# Altium schematic sheet ETHERNET.SchDoc: ETHERHET
size 420 x 297 mm; DrawnBy: Orhun Dabak; Revision: 1.0; SheetNumber: 4; SheetTotal: 7
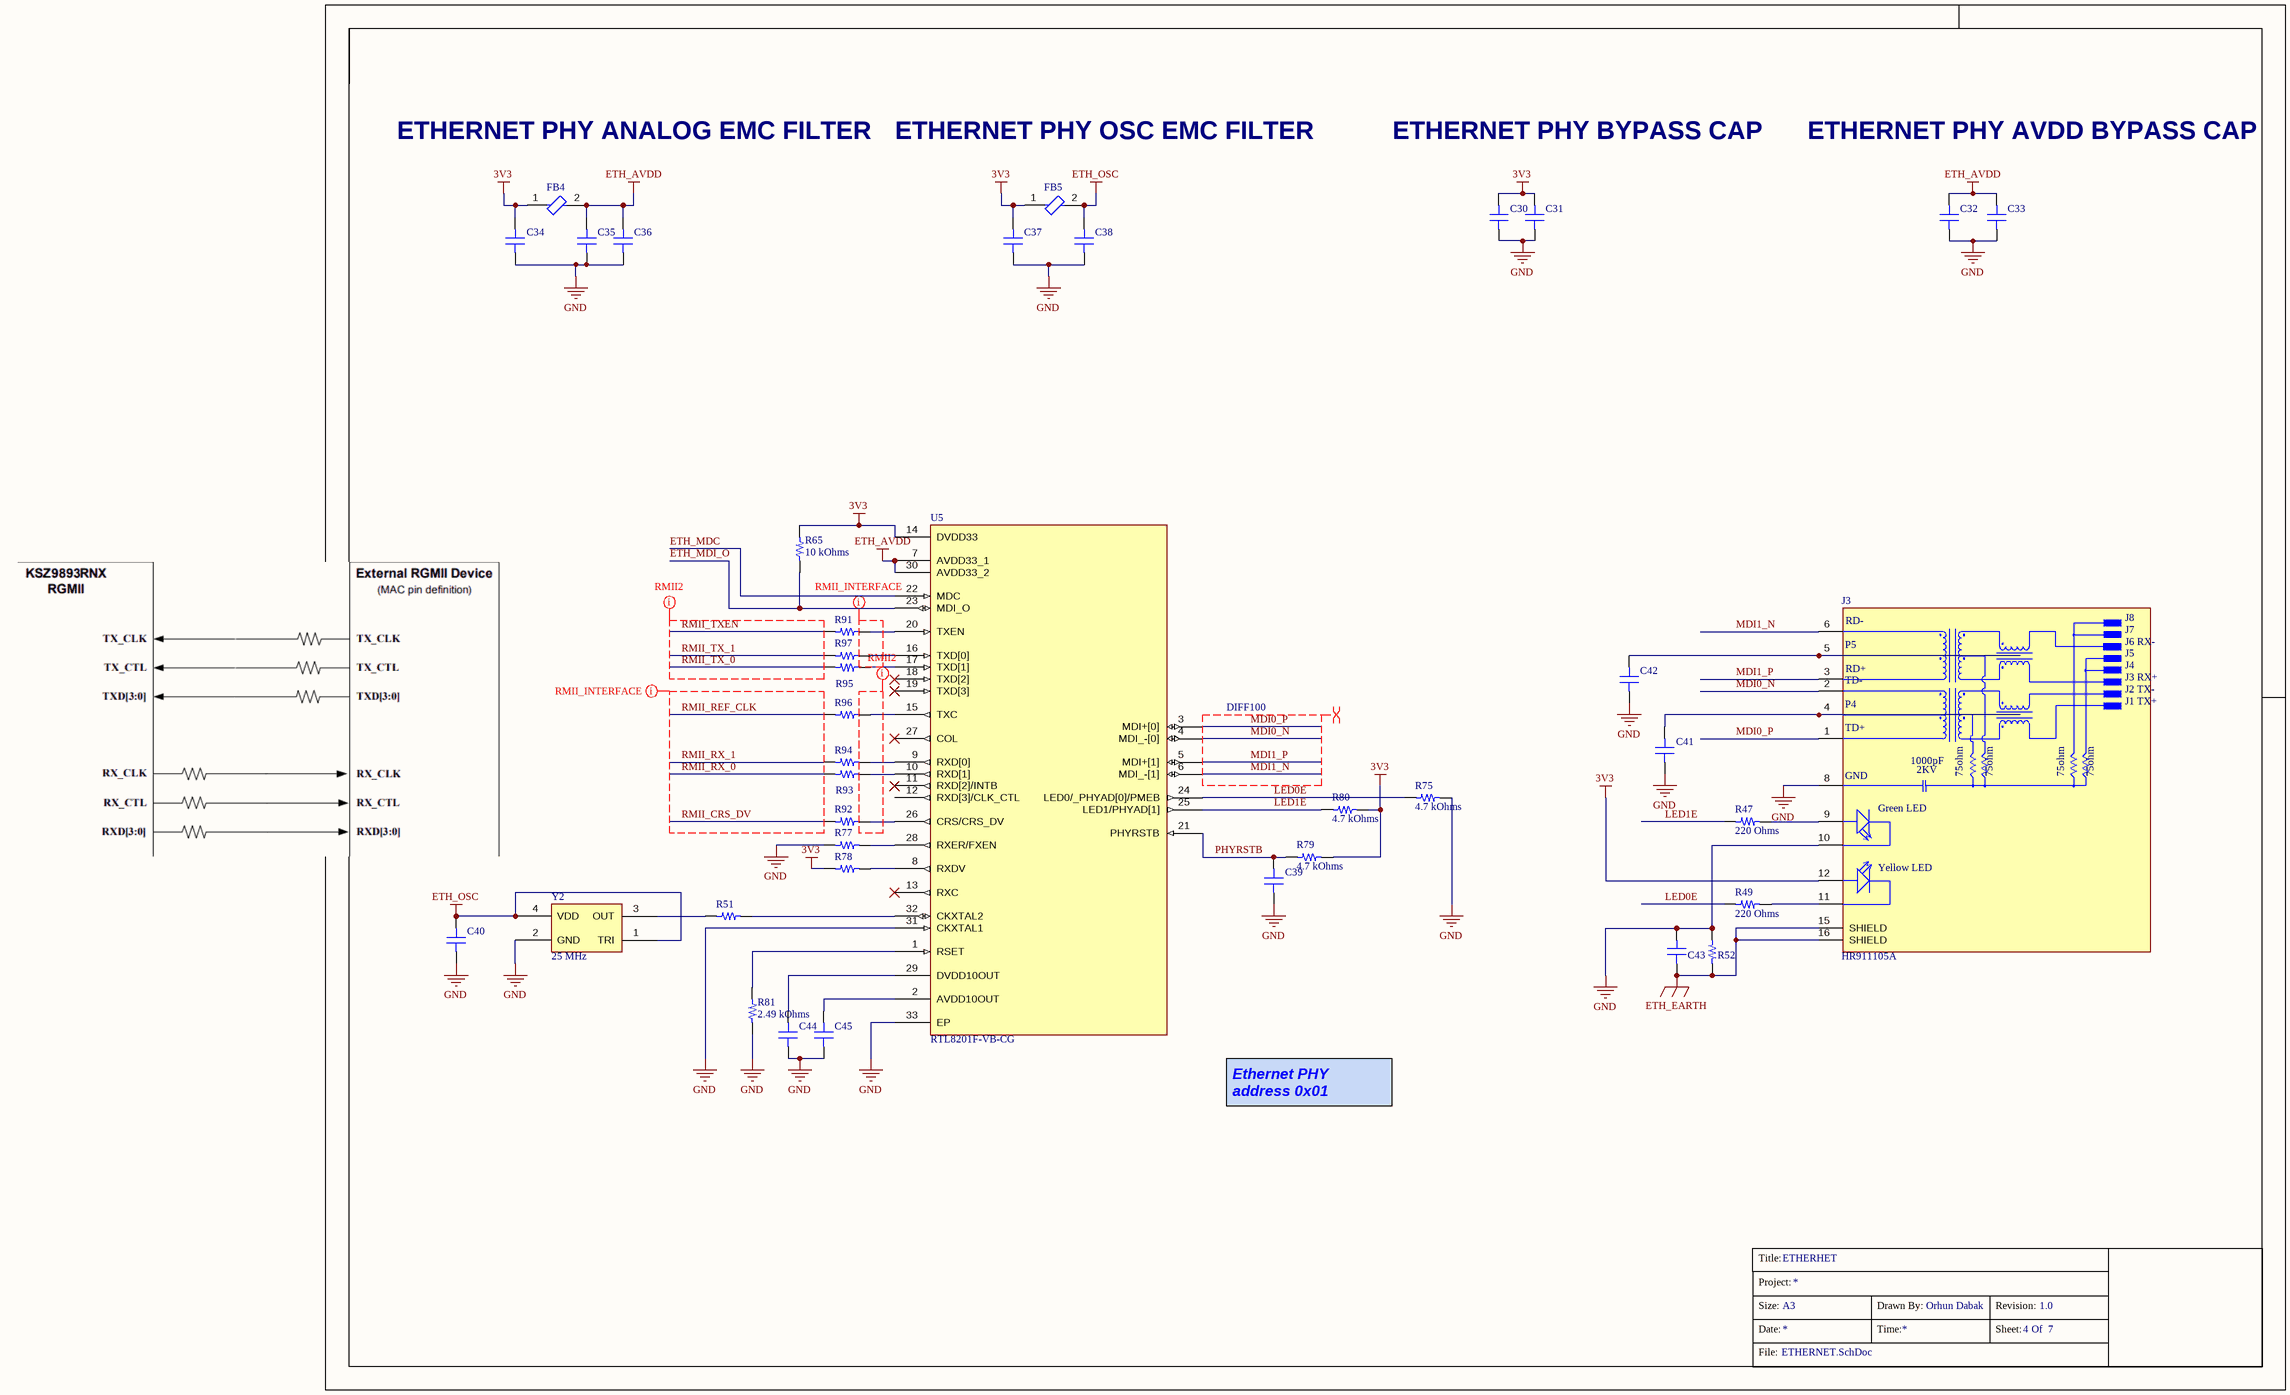
[diagram p0: ETHERNET.SchDoc]

## Parts
?  (no value)  (graphical)
C30  0.1 µF  [CAP 0402_1005]  (value not drawn)
C31  2.2 µF  [CAP 0402_1005]  (value not drawn)
C32  0.1 µF  [CAP 0402_1005]  (value not drawn)
C33  0.1 µF  [CAP 0402_1005]  (value not drawn)
C34  0.1 µF  [CAP 0402_1005]  (value not drawn)
C35  0.1 µF  [CAP 0402_1005]  (value not drawn)
C36  4.7 µF  [CAP 0402_1005]  (value not drawn)
C37  4.7 µF  [CAP 0402_1005]  (value not drawn)
C38  4.7 µF  [CAP 0402_1005]  (value not drawn)
C39  1000pF  [CAP 0402_1005]  (value not drawn)
C40  0.1 µF  [CAP 0402_1005]  (value not drawn)
C41  10000 pF  [CAP 0402_1005]  (value not drawn)
C42  10000 pF  [CAP 0402_1005]  (value not drawn)
C43  4700 pF  [CAP 0402_1005]  (value not drawn)
C44  0.1 µF  [CAP 0402_1005]  (value not drawn)
C45  0.1 µF  [CAP 0402_1005]  (value not drawn)
FB4  BLM15AX601SN1D  [FP-BLM15-0_05-IPC_B]  (value not drawn)
FB5  BLM15AX601SN1D  [FP-BLM15-0_05-IPC_B]  (value not drawn)
J3  HR911105A  [HANRUN_HR911105A]
R47  220 Ohms  [RES 0402_1005]
R49  220 Ohms  [RES 0402_1005]
R51  22 Ohms  [RES 0402_1005]  (value not drawn)
R52  1 MOhms  [RES 0402_1005]  (value not drawn)
R65  10 kOhms  [RES 0402_1005]
R75  4.7 kOhms  [RES 0402_1005]
R77  4.7 kOhms  [RES 0402_1005]  (value not drawn)
R78  10 kOhms  [RES 0402_1005]  (value not drawn)
R79  4.7 kOhms  [RES 0402_1005]
R80  4.7 kOhms  [RES 0402_1005]
R81  2.49 kOhms  [RES 0402_1005]
R91  33 Ohms  [RES 0402_1005]  (value not drawn)
R92  33 Ohms  [RES 0402_1005]  (value not drawn)
R93  33 Ohms  [RES 0402_1005]  (value not drawn)
R94  33 Ohms  [RES 0402_1005]  (value not drawn)
R95  33 Ohms  [RES 0402_1005]  (value not drawn)
R96  33 Ohms  [RES 0402_1005]  (value not drawn)
R97  33 Ohms  [RES 0402_1005]  (value not drawn)
U5  RTL8201F-VB-CG  [QFN50P500X500X100_HS-33N]
Y2  25 MHz  [ABRACON ASE]

## Nets
3V3: C30.2 C31.2 C34.2 C37.2 FB4.1 FB5.1 J3.12(YA) R65.1 R78.1 R79.2 R80.2 U5.14(DVDD33)
ETH_AVDD: C32.2 C33.2 C35.2 C36.2 FB4.2 U5.7(AVDD33_1) U5.30(AVDD33_2)
ETH_EARTH: C43.1 J3.15(SHIELD) J3.16(SHIELD) R52.1
ETH_OSC: C38.2 C40.2 FB5.2 Y2.1(TRI) Y2.4(VDD)
GND: C30.1 C31.1 C32.1 C33.1 C34.1 C35.1 C36.1 C37.1 C38.1 C39.1 C40.1 C41.1 C42.1 C43.2 C44.1 C45.1 J3.8(GND) J3.10(GC) R52.2 R75.2 R77.1 R81.1 U5.31(CKXTAL1) U5.33(EP) Y2.2(GND)
ETH_MDC: U5.22(MDC)
ETH_MDI_O: R65.2 U5.23(MDI_O)
LED0E: R49.2 R75.1 U5.24(LED0/_PHYAD[0]/PMEB)
LED1E: R47.2 R80.1 U5.25(LED1/PHYAD[1])
MDI0_N: J3.2(TD-) U5.4(MDI_-[0])
MDI0_P: J3.1(TD+) U5.3(MDI+[0])
MDI1_N: J3.6(RD-) U5.6(MDI_-[1])
MDI1_P: J3.3(RD+) U5.5(MDI+[1])
PHYRSTB: C39.2 R79.1 U5.21(PHYRSTB)
RMII_CRS_DV: R92.1
RMII_REF_CLK: R96.1
RMII_RX_0: R93.1
RMII_RX_1: R94.1
RMII_TX_0: R95.1
RMII_TX_1: R97.1
RMII_TXEN: R91.1
NetC41_2: C41.2 J3.4(P4)
NetC42_2: C42.2 J3.5(P5)
NetC44_2: C44.2 U5.29(DVDD10OUT)
NetC45_2: C45.2 U5.2(AVDD10OUT)
NetJ3_9: J3.9(GA) R47.1
NetJ3_11: J3.11(YC) R49.1
NetR51_1: R51.1 Y2.3(OUT)
NetR51_2: R51.2 U5.32(CKXTAL2)
NetR77_2: R77.2 U5.28(RXER/FXEN)
NetR78_2: R78.2 U5.8(RXDV)
NetR81_2: R81.2 U5.1(RSET)
NetR91_2: R91.2 U5.20(TXEN)
NetR92_2: R92.2 U5.26(CRS/CRS_DV)
NetR93_2: R93.2 U5.10(RXD[1])
NetR94_2: R94.2 U5.9(RXD[0])
NetR95_2: R95.2 U5.17(TXD[1])
NetR96_2: R96.2 U5.15(TXC)
NetR97_2: R97.2 U5.16(TXD[0])

Not connected (* = marked no-connect by the designer): U5 11(RXD[2]/INTB)* 12(RXD[3]/CLK_CTL) 13(RXC)* 18(TXD[2])* 19(TXD[3])* 27(COL)*

## Layout directives
net class SING_END50; net class RMII: (no net found under the mark), RMII_CRS_DV, RMII_REF_CLK, RMII_RX_0, RMII_RX_1
differential pair; differential pair class DIFF100: MDI0_N, MDI0_P, MDI1_N, MDI1_P
net class RMII2; net class SING_END50: (no net found under the mark), RMII_TX_0, RMII_TX_1, RMII_TXEN

## Notes on the sheet
- ETHERNET PHY ANALOG EMC FILTER
- ETHERNET PHY OSC EMC FILTER
- ETHERNET PHY BYPASS CAP
- ETHERNET PHY AVDD BYPASS CAP
- Ethernet PHY address 0x01
- Title:
- Project:
- Size:
- Date:
- File:
- A3
- Time:
- Drawn By:
- Sheet:
- Revision:
- Of
- (in symbol HR911105A) J8; J7; J6 RX-; J5; J4; J3 RX+; J2 TX-; J1 TX+; 1000pF; 2KV; 75ohm; Green LED; Yellow LED

## Library data of the parts
? = Title_Block
C30 C32-C35 C40 C44 C45 = CC0402KRX7R6BB104: CAP CER 0.1UF 10V X7R 0402; manufacturer: Yageo; Tolerance: ±10%; Part Number: CC0402KRX7R6BB104; Value: 0.1 µF; Applications: General Purpose; Capacitance: 0.1 µF; componentlink1description: Datasheet; componentlink1url: https://www.yageo.com/upload/media/product/productsearch/datasheet/mlcc/UPY-GPHC_X7R_6.3V-to-50V_18.pdf; componentlink2description: DigiKey Link; componentlink2url: https://www.digikey.com/en/products/detail/yageo/CC0402KRX7R6BB104/2103083; Device Package: 0402 (1005 Metric); lastupdated: 19/09/2022 12:57:28; Lifecycle Status: Active; Minimum Order: 1; Mounting Type: Surface Mount, MLCC; Operating Temperature: -55°C ~ 125°C; Package / Case: 0402 (1005 Metric); packaging: CutTape; partid: 3877; Part Status: Active; price: 0.01; series: CC; Size / Dimension: 0.039" L x 0.020" W (1.00mm x 0.50mm); Supplier 1: DigiKey; Supplier Part Number 1: 311-1345-1-ND; Temperature Coefficient: X7R; Thickness (Max): 0.022" (0.55mm); Voltage - Rated: 10V
C31 = C0402C225M8PAC7867: CAP CER 2.2UF 10V X5R 0402; manufacturer: KEMET; Tolerance: ±20%; Part Number: C0402C225M8PAC7867; Value: 2.2 µF; Applications: Bypass, Decoupling; Capacitance: 2.2 µF; componentlink1description: Datasheet; componentlink1url: https://connect.kemet.com:7667/gateway/IntelliData-ComponentDocumentation/1.0/download/datasheet/C0402C225M8PACTU; componentlink2description: DigiKey Link; componentlink2url: https://www.digikey.com/en/products/detail/kemet/C0402C225M8PAC7867/3317581; Device Package: 0402 (1005 Metric); lastupdated: 19/09/2022 12:56:38; Lifecycle Status: Active; Minimum Order: 1; Mounting Type: Surface Mount, MLCC; Operating Temperature: -55°C ~ 85°C; Package / Case: 0402 (1005 Metric); packaging: TapeAndReel; partid: 44976; Part Status: Active; price: 0.02; series: SMD Comm X5R; Size / Dimension: 0.039" L x 0.020" W (1.00mm x 0.50mm); Supplier 1: DigiKey; Supplier Part Number 1: 399-C0402C225M8PAC7867CT-ND; Temperature Coefficient: X5R; Thickness (Max): 0.022" (0.55mm); Voltage - Rated: 10V
C36-C38 = CL05A475MP5NRNC: CAP CER 4.7UF 10V X5R 0402; manufacturer: Samsung Electro-Mechanics; Tolerance: ±20%; Part Number: CL05A475MP5NRNC; Value: 4.7 µF; Applications: General Purpose; Capacitance: 4.7 µF; componentlink1description: Datasheet; componentlink1url: http://www.samsungsem.com/kr/support/product-search/mlcc/CL05A475MP5NRNC.jsp; componentlink2description: DigiKey Link; componentlink2url: https://www.digikey.com/en/products/detail/samsung-electro-mechanics/CL05A475MP5NRNC/3887140; Device Package: 0402 (1005 Metric); lastupdated: 19/09/2022 12:57:17; Lifecycle Status: Active; Minimum Order: 1; Mounting Type: Surface Mount, MLCC; Operating Temperature: -55°C ~ 85°C; Package / Case: 0402 (1005 Metric); packaging: TapeAndReel; partid: 7650; Part Status: Active; price: 0.01; series: CL; Size / Dimension: 0.039" L x 0.020" W (1.00mm x 0.50mm); Supplier 1: DigiKey; Supplier Part Number 1: 1276-1482-1-ND; Temperature Coefficient: X5R; Thickness (Max): 0.022" (0.55mm); Voltage - Rated: 10V
C39 = 0402ZC102KAT2A: CAP CER 1000PF 10V X7R 0402; manufacturer: AVX Corporation; Tolerance: ±10%; Part Number: 0402ZC102KAT2A; Value: 1000pF; Applications: General Purpose; Capacitance: 1000pF; componentlink1description: Datasheet; componentlink1url: http://datasheets.avx.com/X7RDielectric.pdf; componentlink2description: DigiKey Link; componentlink2url: http://digikey.com/product-detail/en/avx-corporation/0402ZC102KAT2A/478-12663-1-ND/9949195; Device Package: 0402 (1005 Metric); lastupdated: 08/02/2022 12:26:49; Lifecycle Status: Active; Minimum Order: 1; Mounting Type: Surface Mount, MLCC; Operating Temperature: -55°C ~ 125°C; Package / Case: 0402 (1005 Metric); packaging: TapeAndReel; partid: 7830; Part Status: Active; price: 0.01; series: -; Size / Dimension: 0.039" L x 0.020" W (1.00mm x 0.50mm); Supplier 1: DigiKey; Supplier Part Number 1: 478-12663-1-ND; Temperature Coefficient: X7R; Thickness (Max): 0.022" (0.56mm); Voltage - Rated: 10V
C41 C42 = C0402C103K5RECAUTO: CAP CER 0402 10NF 50V X7R 10%; manufacturer: KEMET; Part Number: C0402C103K5RECAUTO; Value: 10000 pF; Applications: Automotive, ESD Protection; Capacitance: 10000 pF; componentlink1description: Datasheet; componentlink1url: https://api.kemet.com/component-edge/download/datasheet/C0402C103K5RECAUTO.pdf; componentlink2description: DigiKey Link; componentlink2url: https://www.digikey.com/en/products/detail/kemet/C0402C103K5RECAUTO/8646477; Device Package: 0402 (1005 Metric); lastupdated: 19/09/2022 12:56:43; Lifecycle Status: Active; Minimum Order: 1; Mounting Type: Surface Mount, MLCC; Operating Temperature: -55°C ~ 125°C; Package / Case: 0402 (1005 Metric); packaging: TapeAndReel; partid: 38916; Part Status: Active; price: 0.01; Ratings: AEC-Q200; series: ESD SMD Auto X7R; Size / Dimension: 0.039" L x 0.020" W (1.00mm x 0.50mm); Supplier 1: DigiKey; Supplier Part Number 1: 399-C0402C103K5RECAUTOCT-ND; Temperature Coefficient: X7R; Thickness (Max): 0.022" (0.55mm); Tolerance: ±10%; Voltage - Rated: 50V
C43 = GRM155R72A472KA01D: CAP CER 4700PF 100V X7R 0402; manufacturer: Murata Electronics; Tolerance: ±10%; Part Number: GRM155R72A472KA01D; Value: 4700 pF; Applications: General Purpose; Capacitance: 4700 pF; componentlink1description: Datasheet; componentlink1url: https://www.murata.com/~/media/webrenewal/support/library/catalog/products/capacitor/mlcc/c02e.ashx?la=en-us; componentlink2description: DigiKey Link; componentlink2url: https://www.digikey.com/en/products/detail/murata-electronics/GRM155R72A472KA01D/965899; Device Package: 0402 (1005 Metric); lastupdated: 19/09/2022 12:57:33; Lifecycle Status: Active; Minimum Order: 1; Mounting Type: Surface Mount, MLCC; Operating Temperature: -55°C ~ 125°C; Package / Case: 0402 (1005 Metric); packaging: TapeAndReel; partid: 2046; Part Status: Active; price: 0.01; series: GRM; Size / Dimension: 0.039" L x 0.020" W (1.00mm x 0.50mm); Supplier 1: DigiKey; Supplier Part Number 1: 490-3885-1-ND; Temperature Coefficient: X7R; Thickness (Max): 0.022" (0.55mm); Voltage - Rated: 100V
FB4 FB5 = CMP-0686-00246-4: Chip Ferrite Bead, 0402, 600Ω @ 100MHz, 0.34Ω, 25%, 500mA; Material: Steel; DC Resistance (DCR): 340mR; Impedance: 600R; Number of Circuits: 1; Max Current Rating: 500mA; Core Material: Ferrite; Lead Free: Lead Free; Series: BLM15AX_SN; Number of Pins: 2; Package Quantity: 1; Length: 1mm; Height: 0.5mm; Width: 0.5mm; Packaging: Tape and Reel; RoHS Compliant: Yes; Test Frequency: 100MHz; Case Code (Imperial): 0402; Depth: 0.5mm; Case/Package: 0402; Min Operating Temperature: -55°C; Max Operating Temperature: 125°C; Max DC Current: 500mA; Current Rating: 500mA; REACH SVHC: No SVHC; Termination: SMD/SMT; Tolerance: 25%; Case Code (Metric): 1005; Number of Lines: 1; DC Resistance-Max: 340mR
J3 = HR911105A: DIP RJ45 Connector;; Package: None; MP: HR911105A; Value: *; Price: None; Availability: Unavailable
R47 R49 = RC0402FR-07220RL: RES 220 OHM 1% 1/16W 0402; Manufacturer: Yageo; Power (Watts): 0.063W, 1/16W; Temperature Coefficient: ±100ppm/°C; Part Number: RC0402FR-07220RL; Value: 220 Ohms; ComponentLink1Description: Datasheet; ComponentLink1URL: https://www.yageo.com/upload/media/product/productsearch/datasheet/rchip/PYu-RC_Group_51_RoHS_L_10.pdf; ComponentLink2Description: DigiKey Link; ComponentLink2URL: https://www.digikey.com/en/products/detail/yageo/RC0402FR-07220RL/726565; Composition: Thick Film; Device Package: 0402 (1005 Metric); Features: Moisture Resistant; Height - Seated (Max): 0.016" (0.40mm); LastUpdated: 19/09/2022 13:14:14; Lifecycle Status: Active; Minimum Order: 1; Number of Terminations: 2; Operating Temperature: -55°C ~ 155°C; Package / Case: 0402 (1005 Metric); Packaging: CutTape; PartId: 17956; Part Status: Active; Price: 0.01; Resistance: 220 Ohms; Series: RC_L; Size / Dimension: 0.039" L x 0.020" W (1.00mm x 0.50mm); Supplier 1: DigiKey; Supplier Part Number 1: 311-220LRCT-ND; Supplier Device Package: 0402; Tolerance: ±1%
R51 = RC0402FR-0722RL: RES 22 OHM 1% 1/16W 0402; Manufacturer: Yageo; Power (Watts): 0.063W, 1/16W; Temperature Coefficient: ±100ppm/°C; Part Number: RC0402FR-0722RL; Value: 22 Ohms; ComponentLink1Description: Datasheet; ComponentLink1URL: https://www.yageo.com/upload/media/product/productsearch/datasheet/rchip/PYu-RC_Group_51_RoHS_L_10.pdf; ComponentLink2Description: DigiKey Link; ComponentLink2URL: https://www.digikey.com/en/products/detail/yageo/RC0402FR-0722RL/726562; Composition: Thick Film; Device Package: 0402 (1005 Metric); Features: Moisture Resistant; Height - Seated (Max): 0.016" (0.40mm); LastUpdated: 19/09/2022 13:14:15; Lifecycle Status: Active; Minimum Order: 1; Number of Terminations: 2; Operating Temperature: -55°C ~ 155°C; Package / Case: 0402 (1005 Metric); Packaging: CutTape; PartId: 17600; Part Status: Active; Price: 0.01; Resistance: 22 Ohms; Series: RC_L; Size / Dimension: 0.039" L x 0.020" W (1.00mm x 0.50mm); Supplier 1: DigiKey; Supplier Part Number 1: 311-22.0LRCT-ND; Supplier Device Package: 0402; Tolerance: ±1%
R52 = AC0402FR-071ML: RES SMD 1M OHM 1% 1/16W 0402; Manufacturer: Yageo; Power (Watts): 0.063W, 1/16W; Temperature Coefficient: ±100ppm/°C; Part Number: AC0402FR-071ML; Value: 1 MOhms; ComponentLink1Description: Datasheet; ComponentLink1URL: https://www.yageo.com/upload/media/product/productsearch/datasheet/rchip/PYu-AC_51_RoHS_L_7.pdf; ComponentLink2Description: DigiKey Link; ComponentLink2URL: https://www.digikey.com/en/products/detail/yageo/AC0402FR-071ML/5895164; Composition: Thick Film; Device Package: 0402 (1005 Metric); Features: Automotive AEC-Q200, Moisture Resistant; Height - Seated (Max): 0.015" (0.37mm); LastUpdated: 19/09/2022 13:14:31; Lifecycle Status: Active; Minimum Order: 1; Number of Terminations: 2; Operating Temperature: -55°C ~ 155°C; Package / Case: 0402 (1005 Metric); Packaging: CutTape; PartId: 12043; Part Status: Active; Price: 0.01; Ratings: AEC-Q200; Resistance: 1 MOhms; Series: AC; Size / Dimension: 0.039" L x 0.020" W (1.00mm x 0.50mm); Supplier 1: DigiKey; Supplier Part Number 1: YAG3450CT-ND; Supplier Device Package: 0402; Tolerance: ±1%
R65 R78 = RP73PF1E10KBTD: RES 10K OHM 0.1% 1/10W 0402; Manufacturer: TE Connectivity Passive Product; Power (Watts): 0.1W, 1/10W; Temperature Coefficient: ±25ppm/°C; Part Number: RP73PF1E10KBTD; Value: 10 kOhms; ComponentLink1Description: Datasheet; ComponentLink1URL: https://www.te.com/commerce/DocumentDelivery/DDEController?Action=srchrtrv&DocNm=1773272&DocType=DS&DocLang=English; ComponentLink2Description: DigiKey Link; ComponentLink2URL: https://www.digikey.com/en/products/detail/te-connectivity-passive-product/RP73PF1E10KBTD/8260957; Composition: Thin Film; Device Package: 0402 (1005 Metric); Height - Seated (Max): 0.014" (0.35mm); LastUpdated: 9/19/2022 01:15:04 PM; Lifecycle Status: Active; Minimum Order: 1; Number of Terminations: 2; Operating Temperature: -55°C ~ 155°C; Package / Case: 0402 (1005 Metric); Packaging: TapeAndReel; PartId: 2434; Part Status: Active; Price: 0.09; Resistance: 10 kOhms; Series: RP73, Holsworthy; Size / Dimension: 0.039" L x 0.020" W (1.00mm x 0.50mm); Supplier 1: DigiKey; Supplier Part Number 1: A127415CT-ND; Supplier Device Package: 0402; Tolerance: ±0.1%
R75 R77 R79 R80 = RT0402FRE074K7L: RES SMD 4.7K OHM 1% 1/16W 0402; Manufacturer: Yageo; Power (Watts): 0.063W, 1/16W; Temperature Coefficient: ±50ppm/°C; Part Number: RT0402FRE074K7L; Value: 4.7 kOhms; ComponentLink1Description: Datasheet; ComponentLink1URL: https://www.yageo.com/upload/media/product/productsearch/datasheet/rchip/PYu-RT_1-to-0.01_RoHS_L_11.pdf; ComponentLink2Description: DigiKey Link; ComponentLink2URL: https://www.digikey.com/en/products/detail/yageo/RT0402FRE074K7L/1072052; Composition: Thin Film; Device Package: 0402 (1005 Metric); Height - Seated (Max): 0.014" (0.35mm); LastUpdated: 1/2/2023 08:21:49 PM; Lifecycle Status: Active; Minimum Order: 1; Number of Terminations: 2; Operating Temperature: -55°C ~ 155°C; Package / Case: 0402 (1005 Metric); Packaging: TapeAndReel; PartId: 3198; Part Status: Active; Price: 0.01; Resistance: 4.7 kOhms; Series: RT; Size / Dimension: 0.039" L x 0.020" W (1.00mm x 0.50mm); Supplier 1: DigiKey; Supplier Part Number 1: YAG3347CT-ND; Supplier Device Package: 0402; Tolerance: ±1%
R81 = RR0510P-2491-D: RES SMD 2.49KOHM 0.5% 1/16W 0402; Manufacturer: Susumu; Power (Watts): 0.063W, 1/16W; Temperature Coefficient: ±25ppm/°C; Part Number: RR0510P-2491-D; Value: 2.49 kOhms; ComponentLink1Description: Datasheet; ComponentLink1URL: http://www.susumu.co.jp/common/pdf/n_catalog_partition05_en.pdf; ComponentLink2Description: DigiKey Link; ComponentLink2URL: https://www.digikey.com/en/products/detail/susumu/RR0510P-2491-D/968890; Composition: Thin Film; Device Package: 0402 (1005 Metric); Height - Seated (Max): 0.016" (0.40mm); LastUpdated: 1/2/2023 08:21:48 PM; Lifecycle Status: Active; Minimum Order: 1; Number of Terminations: 2; Operating Temperature: -55°C ~ 125°C; Package / Case: 0402 (1005 Metric); Packaging: TapeAndReel; PartId: 3283; Part Status: Active; Price: 0.01; Resistance: 2.49 kOhms; Series: RR; Size / Dimension: 0.039" L x 0.020" W (1.00mm x 0.50mm); Supplier 1: DigiKey; Supplier Part Number 1: RR05P2.49KDCT-ND; Tolerance: ±0.5%
R91-R97 = RC0402FR-0733RL: RES 33 OHM 1% 1/16W 0402; Manufacturer: Yageo; Power (Watts): 0.063W, 1/16W; Temperature Coefficient: ±100ppm/°C; Part Number: RC0402FR-0733RL; Value: 33 Ohms; ComponentLink1Description: Datasheet; ComponentLink1URL: https://www.yageo.com/upload/media/product/productsearch/datasheet/rchip/PYu-RC_Group_51_RoHS_L_10.pdf; ComponentLink2Description: DigiKey Link; ComponentLink2URL: https://www.digikey.com/en/products/detail/yageo/RC0402FR-0733RL/726593; Composition: Thick Film; Device Package: 0402 (1005 Metric); Features: Moisture Resistant; Height - Seated (Max): 0.016" (0.40mm); LastUpdated: 19/09/2022 13:14:04; Lifecycle Status: Active; Minimum Order: 1; Number of Terminations: 2; Operating Temperature: -55°C ~ 155°C; Package / Case: 0402 (1005 Metric); Packaging: CutTape; PartId: 20555; Part Status: Active; Price: 0.01; Resistance: 33 Ohms; Series: RC_L; Size / Dimension: 0.039" L x 0.020" W (1.00mm x 0.50mm); Supplier 1: DigiKey; Supplier Part Number 1: 311-33.0LRCT-ND; Supplier Device Package: 0402; Tolerance: ±1%
U5 = RTL8201F-VB-CG: Physical Layer Transceivers 2.97V ~ 3.63V IEEE 802.3, 10/100 Base-T/TX/FX PHY MII, SNI, SMI QFN-32_5x5x05P Ethernet ICs ROHS; Manufacturer: Realtek Semicon; ComponentLink1Description: LCSC Link; ComponentLink1URL: https://www.lcsc.com/product-detail/Ethernet-ICs_Realtek-Semicon-RTL8201F-VB-CG_C45044.html; ComponentLink2Description: Datasheet; ComponentLink2URL: https://datasheetspdf.com/pdf-file/845737/Realtek/RTL8201F-VB-CG/1; Manufacturer Part Number: RTL8201F-VB-CG; Category: Communication Interface Chip/UART/485/232/Ethernet ICs; Type: Physical Layer Transceivers; Supply Voltage: 2.97V ~ 3.63V; Standards: IEEE 802.3, 10/100 Base-T/TX/FX PHY; Interface: MII, SNI, SMI; Package: QFN-32_5x5x05P; Supplier 1: Bison Technologies; Supplier Part Number 1: RTL8201F-VB-CG-220741-REALTEK; Supplier 2: Future Electronics; Supplier Part Number 2: 4019222
Y2 = ASE-25.000MHZ-ET: XTAL OSC XO 25.0000MHZ CMOS SMD; Manufacturer: Abracon LLC; Base Resonator: Crystal; Current - Supply (Max): 13mA; Frequency Stability: ±100ppm; Function: Enable/Disable; Voltage - Supply: 3.3V; Part Number: ASE-25.000MHZ-ET; ComponentLink1Description: Datasheet; ComponentLink1URL: https://abracon.com/Oscillators/ASEseries.pdf; ComponentLink2Description: DigiKey Link; ComponentLink2URL: https://www.digikey.com/en/products/detail/abracon-llc/ASE-25-000MHZ-ET/2001354; Frequency: 25 MHz; Height - Seated (Max): 0.047" (1.20mm); LastUpdated: 19/09/2022 13:51:44; Lifecycle Status: Active; Minimum Order: 1; Mounting Type: Surface Mount; Operating Temperature: -20°C ~ 70°C; Output: CMOS; Package / Case: 4-SMD, No Lead; Packaging: TapeAndReel; PartId: 149; Part Status: Active; Price: 0.88; Series: ASE; Size / Dimension: 0.126" L x 0.098" W (3.20mm x 2.50mm); Supplier 1: DigiKey; Supplier Part Number 1: 535-9987-1-ND; Type: XO (Standard); Value: 25 MHz